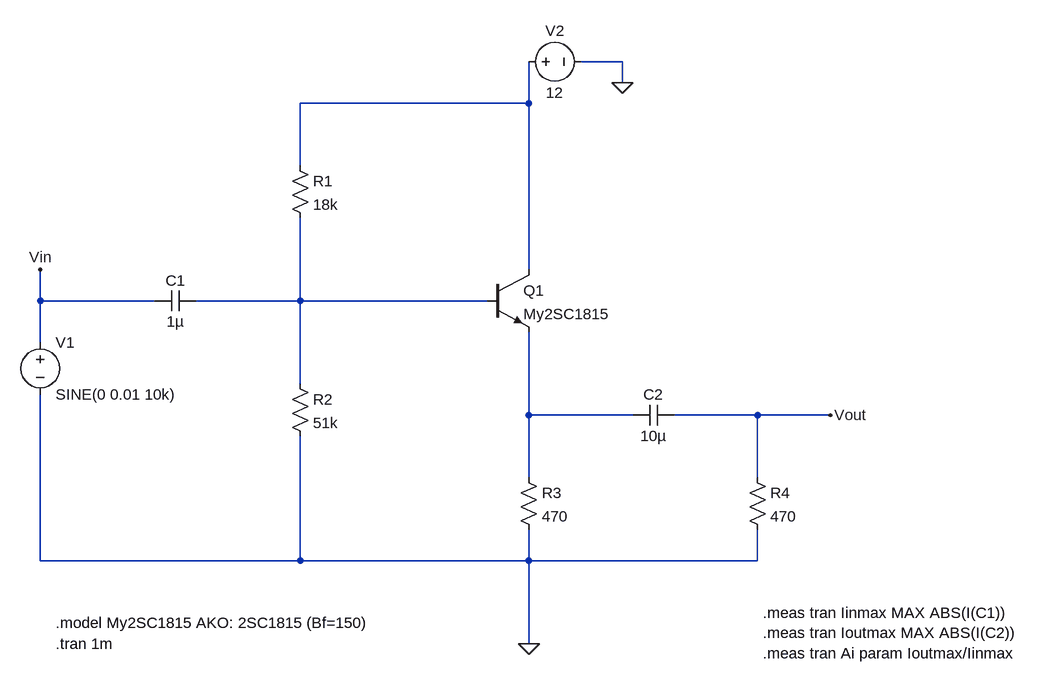
[diagram p0: schematic AC.asc]
AC.asc, the LTspice schematic file:
Version 4.1
SHEET 1 1136 760
WIRE 480 -160 416 -160
WIRE 480 -128 480 -160
WIRE 336 -96 336 -160
WIRE 336 -96 -16 -96
WIRE -16 0 -16 -96
WIRE 336 160 336 -96
WIRE -416 208 -416 160
WIRE -240 208 -416 208
WIRE -16 208 -16 80
WIRE -16 208 -176 208
WIRE 272 208 -16 208
WIRE -416 272 -416 208
WIRE -16 336 -16 208
WIRE 336 384 336 256
WIRE 496 384 336 384
WIRE 688 384 560 384
WIRE 800 384 688 384
WIRE 336 480 336 384
WIRE 688 480 688 384
WIRE -416 608 -416 352
WIRE -16 608 -16 416
WIRE -16 608 -416 608
WIRE 336 608 336 560
WIRE 336 608 -16 608
WIRE 688 608 688 560
WIRE 688 608 336 608
WIRE 336 736 336 608
FLAG 336 736 0
FLAG 480 -128 0
FLAG -416 160 Vin
FLAG 800 384 Vout
SYMBOL res -32 -16 R0
SYMATTR InstName R1
SYMATTR Value 18k
SYMBOL res -32 320 R0
SYMATTR InstName R2
SYMATTR Value 51k
SYMBOL res 320 464 R0
SYMATTR InstName R3
SYMATTR Value 470
SYMBOL res 672 464 R0
SYMATTR InstName R4
SYMATTR Value 470
SYMBOL cap -176 192 R90
WINDOW 0 0 32 VBottom 2
WINDOW 3 32 32 VTop 2
SYMATTR InstName C1
SYMATTR Value 1µ
SYMBOL cap 560 368 R90
WINDOW 0 0 32 VBottom 2
WINDOW 3 32 32 VTop 2
SYMATTR InstName C2
SYMATTR Value 10µ
SYMBOL voltage -416 256 R0
WINDOW 123 0 0 Left 0
WINDOW 39 0 0 Left 0
SYMATTR InstName V1
SYMATTR Value SINE(0 0.01 10k)
SYMBOL voltage 320 -160 R270
WINDOW 0 32 56 VTop 2
WINDOW 3 -32 56 VBottom 2
SYMATTR InstName V2
SYMATTR Value 12
SYMBOL npn 272 160 R0
SYMATTR InstName Q1
SYMATTR Value My2SC1815
TEXT -392 704 Left 2 !.model My2SC1815 AKO: 2SC1815 (Bf=150)
TEXT -392 736 Left 2 !.tran 1m
TEXT 696 688 Left 2 !.meas tran Iinmax MAX ABS(I(C1))\n.meas tran Ioutmax MAX ABS(I(C2))\n.meas tran Ai param Ioutmax/Iinmax

The netlist it stands for:
* AC.asc
R1 N001 N002 18k
R2 N002 0 51k
R3 N003 0 470
R4 Vout 0 470
C1 N002 Vin 1µ
C2 Vout N003 10µ
V1 Vin 0 SINE(0 0.01 10k)
V2 N001 0 12
Q1 N001 N002 N003 0 My2SC1815
.model NPN NPN
.model PNP PNP
.lib standard.bjt
.model My2SC1815 AKO: 2SC1815 (Bf=150)
.tran 1m
.meas tran Iinmax MAX ABS(I(C1))
.meas tran Ioutmax MAX ABS(I(C2))
.meas tran Ai param Ioutmax/Iinmax
.backanno
.end

* Results of the author's LTspice run, read from the files saved beside the schematic
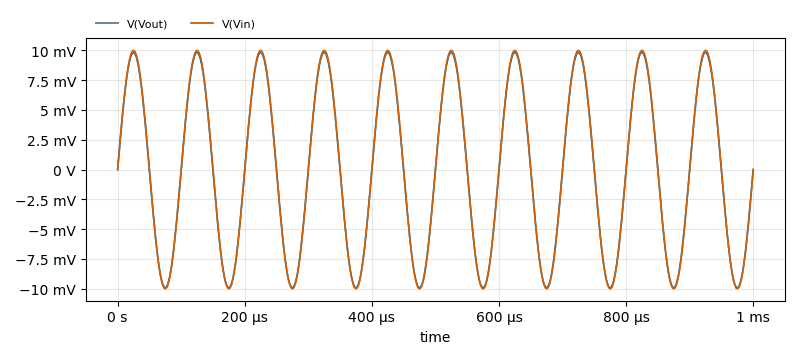
[diagram p1: Transient Analysis of AC.asc, plotted from the saved traces]
* Transient Analysis, 1 run:
*   V(Vout): min -9.922 mV, max 9.83 mV, average -45.38 µV, rms 6.981 mV, last 11.71 µV
*   V(Vin): min -10 mV, max 10 mV, average -1.235 nV, rms 7.072 mV, last 0 V